# Altium schematic sheet E_stop.SchDoc
size A
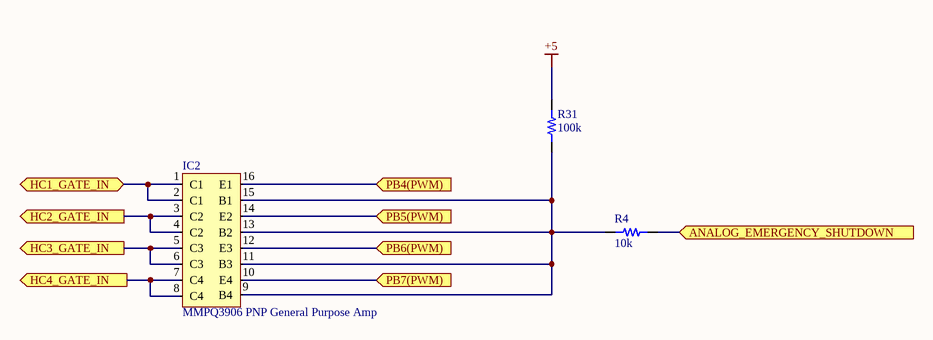
[diagram p0: E_stop.SchDoc]

## Parts
IC2  MMPQ3906 PNP General Purpose Amp  [SOIC-16-NB]
R4  value 10k  [RES 0805/2012]  (hidden comment: Resistor 10k 0805 1/10W 1%)
R31  value 100k  [RES 0805/2012]  (hidden comment: Resistor 100k 0805 1/2W 1%)

## Ports
ANALOG_EMERGENCY_SHUTDOWN (in), HC1_GATE_IN (bidir), HC2_GATE_IN (out), HC3_GATE_IN (out), HC4_GATE_IN (out), PB4(PWM) (in), PB5(PWM) (in), PB6(PWM) (in), PB7(PWM) (in)

## Nets
+5: R31.2
ANALOG_EMERGENCY_SHUTDOWN: R4.2 ; port ANALOG_EMERGENCY_SHUTDOWN
HC1_GATE_IN: IC2.1(C1) IC2.2(C1) ; port HC1_GATE_IN
HC2_GATE_IN: IC2.3(C2) IC2.4(C2) ; port HC2_GATE_IN
HC3_GATE_IN: IC2.5(C3) IC2.6(C3) ; port HC3_GATE_IN
HC4_GATE_IN: IC2.7(C4) IC2.8(C4) ; port HC4_GATE_IN
PB4(PWM): IC2.16(E1) ; port PB4(PWM)
PB5(PWM): IC2.14(E2) ; port PB5(PWM)
PB6(PWM): IC2.12(E3) ; port PB6(PWM)
PB7(PWM): IC2.10(E4) ; port PB7(PWM)
NetIC2_9: IC2.9(B4) IC2.11(B3) IC2.13(B2) IC2.15(B1) R4.1 R31.1

## Library data of the parts
IC2 = 20: idIC_Misc: 20
R4 = 529: Manufacturer_id: 1; idResistor: 529; Name: Res_10k_0805_1/10W_1%; Created_By: Nick Mah; Supplier 1: Digi-Key; Drawer_id: 1; Tolerance: 1%; Power: 1/10W; Package: 0805; ComponentLink1Description: Datasheet; Created_Date: 2018-10-20
R31 = 985: Manufacturer_id: 1; idResistor: 985; Name: Res_100k_0805_1/2W_1%; Created_By: Nick Mah; Supplier 1: Digi-Key; Drawer_id: 1; Tolerance: 1%; Power: 1/2W; Package: 0805; ComponentLink1Description: Datasheet; Created_Date: 2018-10-20